# Altium schematic sheet speaker.SchDoc
size Letter
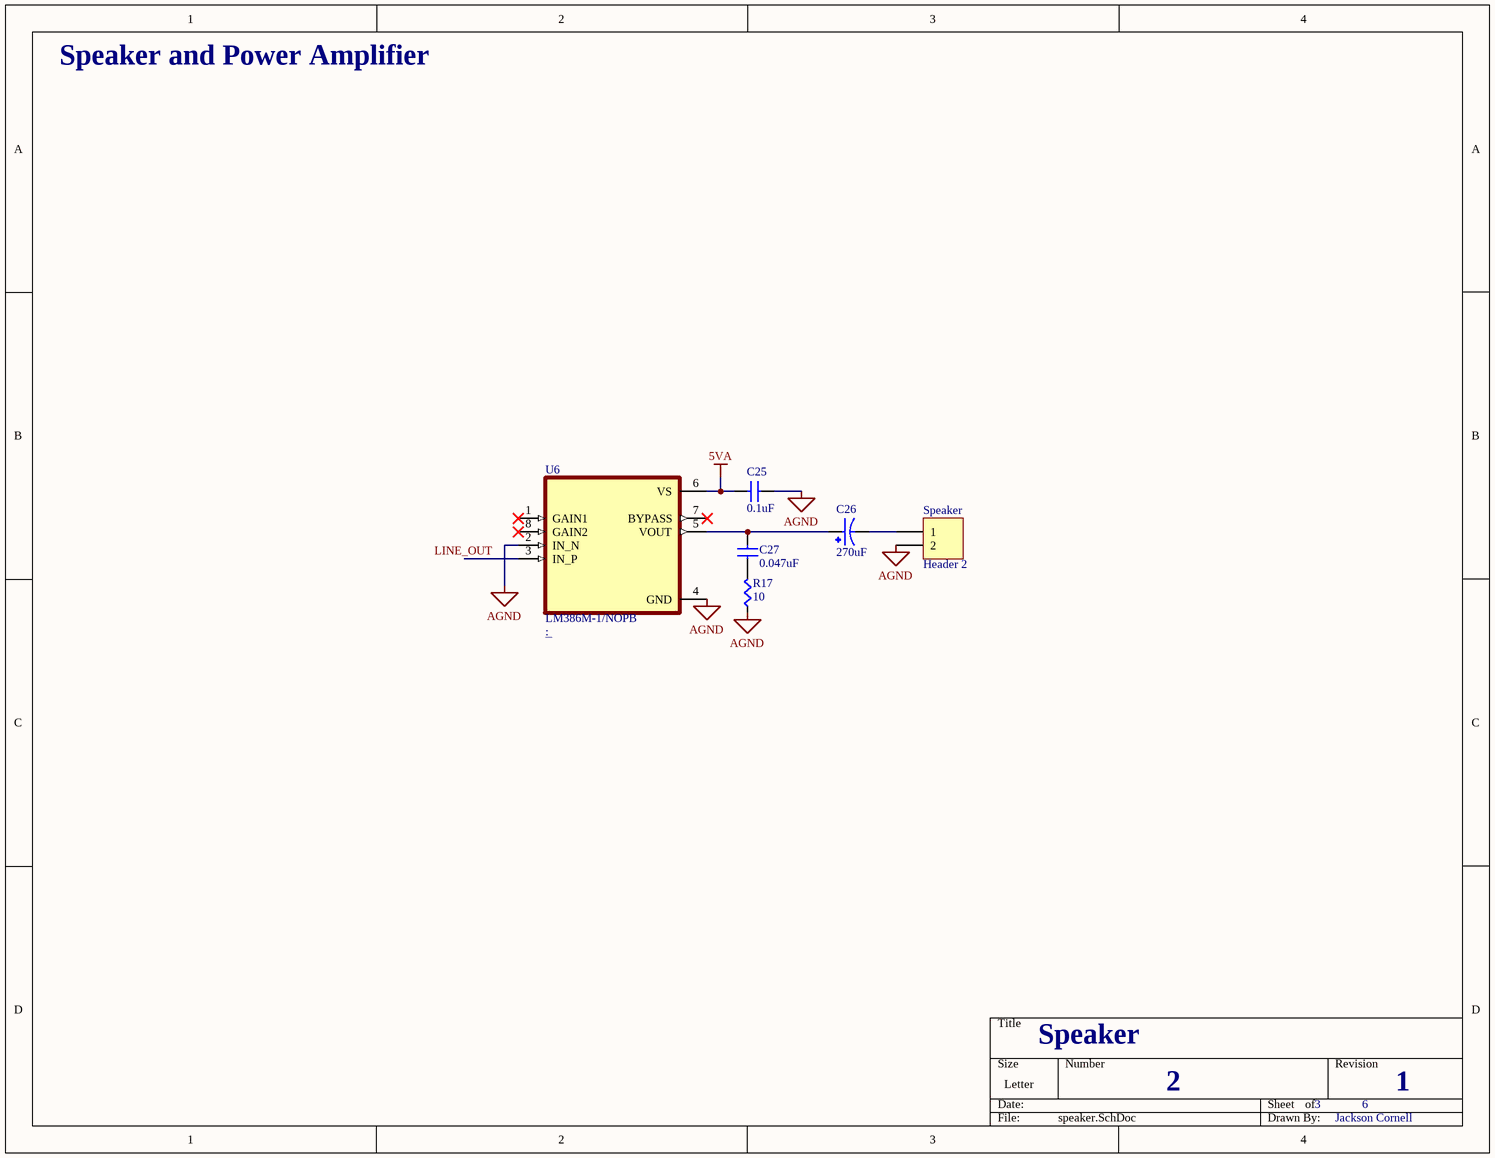
[diagram p0: speaker.SchDoc]

## Parts
C25  value 0.1uF  [CAPC0805]  (hidden comment: Cap)
C26  270uF  [CAPPRD500W50D500H1100]
C27  value 0.047uF  [CAPC0805]  (hidden comment: Cap)
R17  value 10  [RES0805]  (hidden comment: Res)
Speaker  Header 2  [HDR1X2]
U6  LM386M-1/NOPB  [SOP65P490X110-8N]

## Nets
5VA: C25.2(B) U6.6(VS)
AGND: C25.1(A) R17.2(B) Speaker.2 U6.2(IN_N) U6.4(GND)
LINE_OUT: U6.3(IN_P)
NetC26_N: C26.N Speaker.1
NetC26_P: C26.P C27.1(A) U6.5(VOUT)
NetC27_2: C27.2(B) R17.1(A)

Not connected (* = marked no-connect by the designer): U6 1(GAIN1)* 7(BYPASS)* 8(GAIN2)*

## Notes on the sheet
- Speaker and Power Amplifier
- Speaker
- 2
- 3
- 6
- 1
- Jackson Cornell

## Library data of the parts
C26 = EEUFS0J221B: Aluminum Electrolytic Capacitors, 220uF, 6.3V, -40 to 105C; MF: Panasonic; Check_prices: https://www.snapeda.com/parts/EEUFS0J221B/Panasonic/view-part/5796863/?ref=eda; Availability: In Stock; Price: None; Package: RADIAL-2 Panasonic; Value: *; SnapEDA_Link: https://www.snapeda.com/parts/EEUFS0J221B/Panasonic/view-part/5796863/?ref=snap; Purchase-URL: https://pricing.snapeda.com/search/part/EEUFS0J221B/?ref=eda; MP: EEUFS0J221B
Speaker = Header 2: Header, 2-Pin; LatestRevisionDate: 17-Jul-2002; LatestRevisionNote: Re-released for DXP Platform.; Publisher: Altium Limited
U6 = LM386M-1/NOPB: Wide Input Voltage Low Power Audio Amplifier with Internal Gain; MF: Texas Instruments; SnapEDA_Link: https://www.snapeda.com/parts/LM386M-1/Texas%20Instruments/view-part/2583261/?ref=snap; Availability: Unavailable; Package: SOIC-8 Texas Instruments; Price: None; MP: LM386M-1; Value: *
C25 C27 = Cap: Supplier 1: Digi-Key; Supplier Part Number 1: 1276-1000-1-ND
R17 = Res: Supplier 1: Digi-Key; Supplier Part Number 1: RMCF0603JT10K0CT-ND